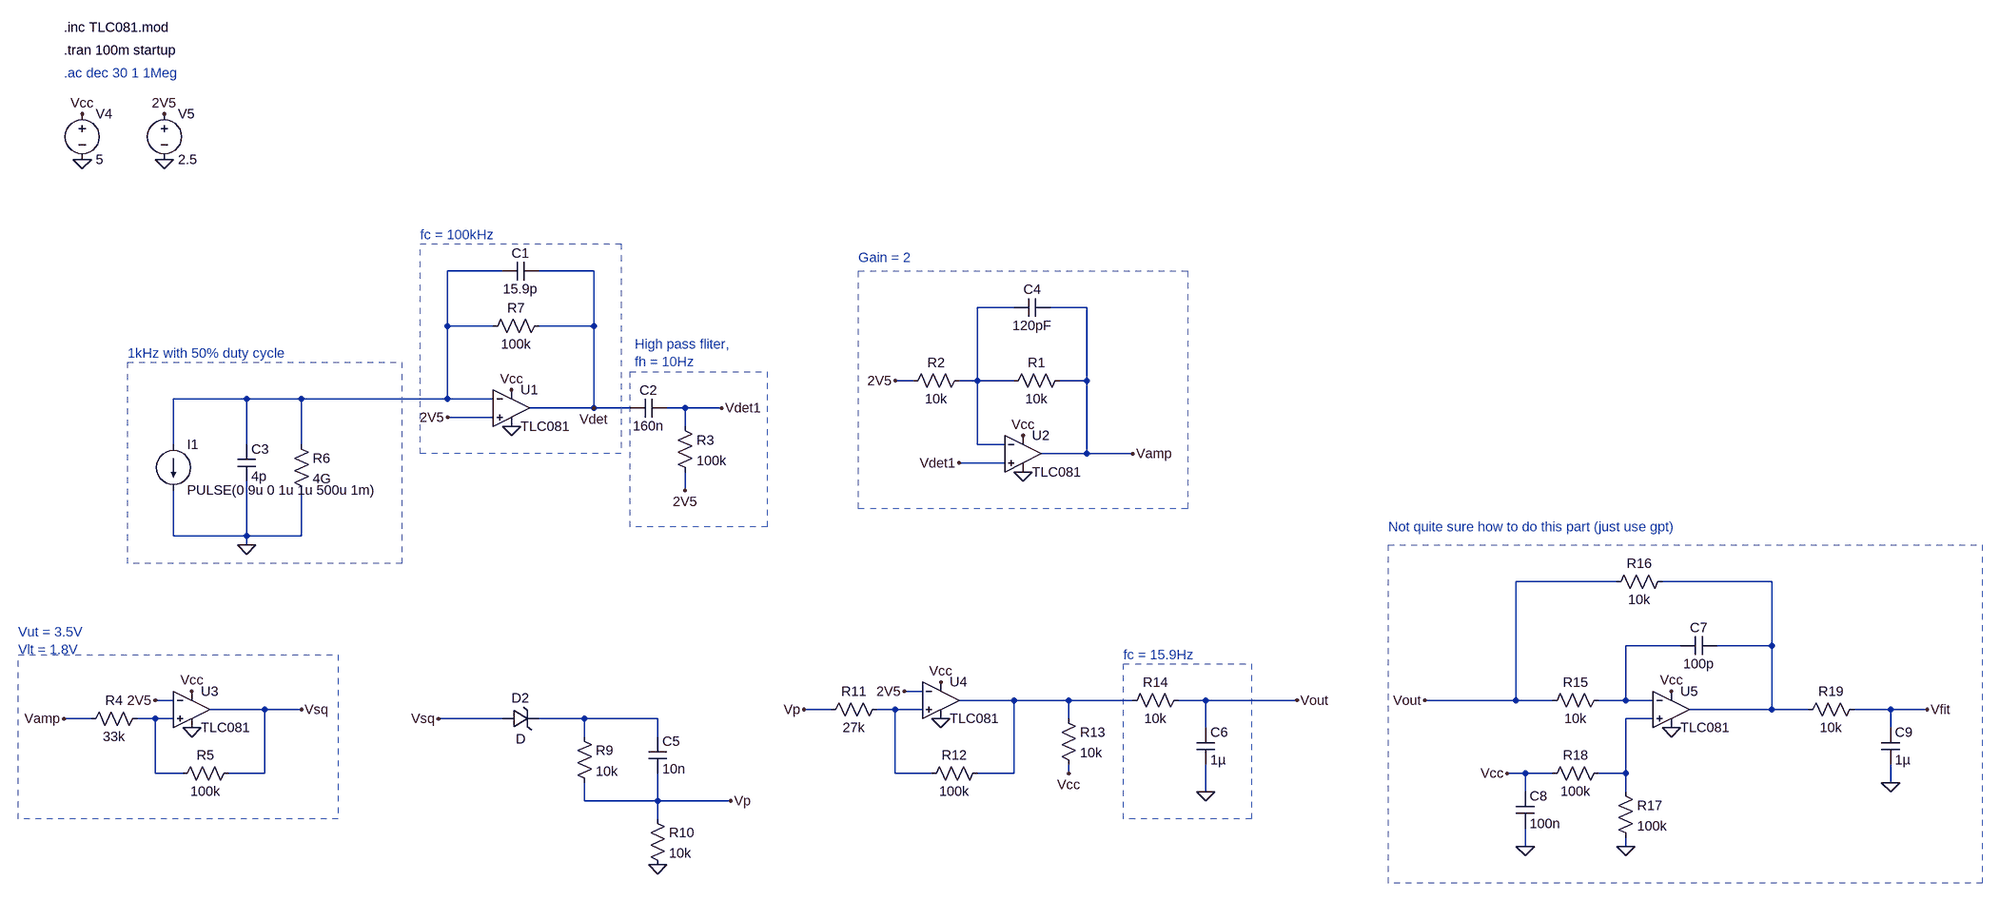
[diagram p0: schematic Receiver.asc]
Receiver.asc, the LTspice schematic file:
Version 4.1
SHEET 1 5412 1812
WIRE -224 736 -320 736
WIRE -64 736 -160 736
WIRE 672 800 608 800
WIRE 800 800 736 800
WIRE -320 832 -320 736
WIRE -240 832 -320 832
WIRE -64 832 -64 736
WIRE -64 832 -160 832
WIRE 496 928 464 928
WIRE 608 928 608 800
WIRE 608 928 576 928
WIRE 672 928 608 928
WIRE 800 928 800 800
WIRE 800 928 752 928
WIRE -672 960 -800 960
WIRE -576 960 -672 960
WIRE -320 960 -320 832
WIRE -320 960 -576 960
WIRE -240 960 -320 960
WIRE -64 976 -64 832
WIRE -64 976 -176 976
WIRE 0 976 -64 976
WIRE 96 976 64 976
WIRE 160 976 96 976
WIRE -240 992 -320 992
WIRE 96 1008 96 976
WIRE -800 1040 -800 960
WIRE -672 1040 -672 960
WIRE -576 1040 -576 960
WIRE 608 1040 608 928
WIRE 656 1040 608 1040
WIRE 800 1056 800 928
WIRE 800 1056 720 1056
WIRE 880 1056 800 1056
WIRE 656 1072 576 1072
WIRE 96 1120 96 1088
WIRE -800 1200 -800 1120
WIRE -672 1200 -672 1104
WIRE -672 1200 -800 1200
WIRE -576 1200 -576 1120
WIRE -576 1200 -672 1200
WIRE -672 1216 -672 1200
WIRE 1936 1280 1760 1280
WIRE 2208 1280 2016 1280
WIRE 2048 1392 1952 1392
WIRE 2208 1392 2208 1280
WIRE 2208 1392 2112 1392
WIRE 512 1472 480 1472
WIRE -800 1488 -832 1488
WIRE 672 1488 576 1488
WIRE 768 1488 672 1488
WIRE 880 1488 768 1488
WIRE 1008 1488 960 1488
WIRE 1168 1488 1008 1488
WIRE 1760 1488 1760 1280
WIRE 1760 1488 1600 1488
WIRE 1824 1488 1760 1488
WIRE 1952 1488 1952 1392
WIRE 1952 1488 1904 1488
WIRE 2000 1488 1952 1488
WIRE -640 1504 -736 1504
WIRE -576 1504 -640 1504
WIRE 352 1504 304 1504
WIRE 464 1504 432 1504
WIRE 512 1504 464 1504
WIRE 2208 1504 2208 1392
WIRE 2208 1504 2064 1504
WIRE 2272 1504 2208 1504
WIRE 2416 1504 2352 1504
WIRE 2480 1504 2416 1504
WIRE -944 1520 -992 1520
WIRE -832 1520 -864 1520
WIRE -800 1520 -832 1520
WIRE -224 1520 -336 1520
WIRE -80 1520 -160 1520
WIRE 48 1520 -80 1520
WIRE 768 1520 768 1488
WIRE 2000 1520 1952 1520
WIRE 1008 1536 1008 1488
WIRE 2416 1536 2416 1504
WIRE -80 1552 -80 1520
WIRE 48 1552 48 1520
WIRE -832 1616 -832 1520
WIRE -784 1616 -832 1616
WIRE -640 1616 -640 1504
WIRE -640 1616 -704 1616
WIRE 464 1616 464 1504
WIRE 528 1616 464 1616
WIRE 672 1616 672 1488
WIRE 672 1616 608 1616
WIRE 768 1616 768 1600
WIRE 1776 1616 1744 1616
WIRE 1824 1616 1776 1616
WIRE 1952 1616 1952 1520
WIRE 1952 1616 1904 1616
WIRE 2416 1632 2416 1600
WIRE 1008 1648 1008 1600
WIRE 1776 1648 1776 1616
WIRE 1952 1648 1952 1616
WIRE -80 1664 -80 1632
WIRE 48 1664 48 1616
WIRE 48 1664 -80 1664
WIRE 176 1664 48 1664
WIRE 48 1696 48 1664
WIRE 1776 1744 1776 1712
WIRE 1952 1744 1952 1728
FLAG -208 1008 0
FLAG -208 944 Vcc
FLAG -320 992 2V5
FLAG -960 464 0
FLAG -960 384 Vcc
FLAG -816 464 0
FLAG -816 384 2V5
FLAG -672 1216 0
FLAG 464 928 2V5
FLAG 688 1088 0
FLAG 688 1024 Vcc
FLAG 576 1072 Vdet1
FLAG 96 1120 2V5
FLAG 160 976 Vdet1
FLAG -64 976 Vdet
FLAG 880 1056 Vamp
FLAG -768 1472 Vcc
FLAG -768 1536 0
FLAG -992 1520 Vamp
FLAG -832 1488 2V5
FLAG -576 1504 Vsq
FLAG 48 1776 0
FLAG -336 1520 Vsq
FLAG 176 1664 Vp
FLAG 304 1504 Vp
FLAG 480 1472 2V5
FLAG 544 1520 0
FLAG 544 1456 Vcc
FLAG 768 1616 Vcc
FLAG 1008 1648 0
FLAG 1168 1488 Vout
FLAG 2032 1472 Vcc
FLAG 2032 1536 0
FLAG 1744 1616 Vcc
FLAG 1776 1744 0
FLAG 1952 1744 0
FLAG 2416 1632 0
FLAG 2480 1504 Vfit
FLAG 1600 1488 Vout
SYMBOL current -800 1040 R0
WINDOW 123 24 108 Left 2
WINDOW 39 0 0 Left 0
SYMATTR InstName I1
SYMATTR Value PULSE(0 9u 0 1u 1u 500u 1m)
SYMBOL cap -688 1040 R0
SYMATTR InstName C3
SYMATTR Value 4p
SYMBOL res -592 1024 R0
SYMATTR InstName R6
SYMATTR Value 4G
SYMBOL res -144 816 R90
WINDOW 0 0 56 VBottom 2
WINDOW 3 32 56 VTop 2
SYMATTR InstName R7
SYMATTR Value 100k
SYMBOL voltage -960 368 R0
SYMATTR InstName V4
SYMATTR Value 5
SYMBOL voltage -816 368 R0
WINDOW 123 0 0 Left 0
WINDOW 39 0 0 Left 0
SYMATTR InstName V5
SYMATTR Value 2.5
SYMBOL cap -160 720 R90
WINDOW 0 0 32 VBottom 2
WINDOW 3 32 32 VTop 2
SYMATTR InstName C1
SYMATTR Value 15.9p
SYMBOL res 768 912 R90
WINDOW 0 0 56 VBottom 2
WINDOW 3 32 56 VTop 2
SYMATTR InstName R1
SYMATTR Value 10k
SYMBOL res 592 912 R90
WINDOW 0 0 56 VBottom 2
WINDOW 3 32 56 VTop 2
SYMATTR InstName R2
SYMATTR Value 10k
SYMBOL cap 64 960 R90
WINDOW 0 0 32 VBottom 2
WINDOW 3 32 32 VTop 2
SYMATTR InstName C2
SYMATTR Value 160n
SYMBOL res 80 992 R0
SYMATTR InstName R3
SYMATTR Value 100k
SYMBOL cap 736 784 R90
WINDOW 0 0 32 VBottom 2
WINDOW 3 32 32 VTop 2
SYMATTR InstName C4
SYMATTR Value 120pF
SYMBOL res -848 1504 R90
WINDOW 0 0 56 VBottom 2
WINDOW 3 32 56 VTop 2
SYMATTR InstName R4
SYMATTR Value 33k
SYMBOL res -688 1600 R90
WINDOW 0 0 56 VBottom 2
WINDOW 3 32 56 VTop 2
SYMATTR InstName R5
SYMATTR Value 100k
SYMBOL zener -224 1536 R270
WINDOW 0 36 32 VTop 2
WINDOW 3 -4 32 VBottom 2
SYMATTR InstName D2
SYMBOL res -96 1536 R0
SYMATTR InstName R9
SYMATTR Value 10k
SYMBOL cap 32 1552 R0
SYMATTR InstName C5
SYMATTR Value 10n
SYMBOL res 32 1680 R0
SYMATTR InstName R10
SYMATTR Value 10k
SYMBOL res 448 1488 R90
WINDOW 0 0 56 VBottom 2
WINDOW 3 32 56 VTop 2
SYMATTR InstName R11
SYMATTR Value 27k
SYMBOL res 624 1600 R90
WINDOW 0 0 56 VBottom 2
WINDOW 3 32 56 VTop 2
SYMATTR InstName R12
SYMATTR Value 100k
SYMBOL res 752 1504 R0
SYMATTR InstName R13
SYMATTR Value 10k
SYMBOL res 976 1472 R90
WINDOW 0 0 56 VBottom 2
WINDOW 3 32 56 VTop 2
SYMATTR InstName R14
SYMATTR Value 10k
SYMBOL cap 992 1536 R0
SYMATTR InstName C6
SYMATTR Value 1µ
SYMBOL OpAmps\\opamp2 -208 912 R0
SYMATTR InstName U1
SYMATTR Value TLC081
SYMBOL OpAmps\\opamp2 688 992 R0
SYMATTR InstName U2
SYMATTR Value TLC081
SYMBOL OpAmps\\opamp2 -768 1440 R0
SYMATTR InstName U3
SYMATTR Value TLC081
SYMBOL OpAmps\\opamp2 544 1424 R0
SYMATTR InstName U4
SYMATTR Value TLC081
SYMBOL res 1920 1472 R90
WINDOW 0 0 56 VBottom 2
WINDOW 3 32 56 VTop 2
SYMATTR InstName R15
SYMATTR Value 10k
SYMBOL OpAmps\\opamp2 2032 1440 R0
SYMATTR InstName U5
SYMATTR Value TLC081
SYMBOL cap 2112 1376 R90
WINDOW 0 0 32 VBottom 2
WINDOW 3 32 32 VTop 2
SYMATTR InstName C7
SYMATTR Value 100p
SYMBOL res 2032 1264 R90
WINDOW 0 0 56 VBottom 2
WINDOW 3 32 56 VTop 2
SYMATTR InstName R16
SYMATTR Value 10k
SYMBOL res 1936 1632 R0
SYMATTR InstName R17
SYMATTR Value 100k
SYMBOL cap 1760 1648 R0
SYMATTR InstName C8
SYMATTR Value 100n
SYMBOL res 1920 1600 R90
WINDOW 0 0 56 VBottom 2
WINDOW 3 32 56 VTop 2
SYMATTR InstName R18
SYMATTR Value 100k
SYMBOL res 2368 1488 R90
WINDOW 0 0 56 VBottom 2
WINDOW 3 32 56 VTop 2
SYMATTR InstName R19
SYMATTR Value 10k
SYMBOL cap 2400 1536 R0
SYMATTR InstName C9
SYMATTR Value 1µ
TEXT -992 272 Left 2 !.tran 100m startup
TEXT -992 232 Left 2 !.inc TLC081.mod
TEXT -880 880 Left 2 ;1kHz with 50% duty cycle
TEXT -368 672 Left 2 ;fc = 100kHz
TEXT 8 864 Left 2 ;High pass fliter,\nfh = 10Hz
TEXT 400 712 Left 2 ;Gain = 2
TEXT -992 312 Left 2 ;.ac dec 30 1 1Meg
TEXT -1072 1368 Left 2 ;Vut = 3.5V\nVlt = 1.8V
TEXT 864 1408 Left 2 ;fc = 15.9Hz
TEXT 1536 1184 Left 2 ;Not quite sure how to do this part (just use gpt)
RECTANGLE Normal -400 1248 -880 896 2
RECTANGLE Normal -16 1056 -368 688 2
RECTANGLE Normal 240 1184 0 912 2
RECTANGLE Normal 976 1152 400 736 2
RECTANGLE Normal -512 1696 -1072 1408 2
RECTANGLE Normal 1088 1696 864 1424 2
RECTANGLE Normal 2576 1808 1536 1216 2

The netlist it stands for:
* Receiver.asc
I1 N001 0 PULSE(0 9u 0 1u 1u 500u 1m)
C3 N001 0 4p
R6 N001 0 4G
R7 Vdet N001 100k
V4 Vcc 0 5
V5 2V5 0 2.5
C1 Vdet N001 15.9p
R1 Vamp N002 10k
R2 N002 2V5 10k
C2 Vdet1 Vdet 160n
R3 Vdet1 2V5 100k
C4 Vamp N002 120pF
R4 N007 Vamp 33k
R5 Vsq N007 100k
D2 Vsq N008 D
R9 N008 Vp 10k
C5 N008 Vp 10n
R10 Vp 0 10k
R11 N006 Vp 27k
R12 N005 N006 100k
R13 N005 Vcc 10k
R14 Vout N005 10k
C6 Vout 0 1µ
X§U1 2V5 N001 Vcc 0 Vdet TLC081  ; pins In+ In- V+ V- OUT
X§U2 Vdet1 N002 Vcc 0 Vamp TLC081  ; pins In+ In- V+ V- OUT
X§U3 N007 2V5 Vcc 0 Vsq TLC081  ; pins In+ In- V+ V- OUT
X§U4 N006 2V5 Vcc 0 N005 TLC081  ; pins In+ In- V+ V- OUT
R15 N004 Vout 10k
X§U5 N009 N004 Vcc 0 N003 TLC081  ; pins In+ In- V+ V- OUT
C7 N003 N004 100p
R16 N003 Vout 10k
R17 N009 0 100k
C8 Vcc 0 100n
R18 N009 Vcc 100k
R19 Vfit N003 10k
C9 Vfit 0 1µ
.model D D
.lib standard.dio
.tran 100m startup
.inc TLC081.mod
* 1kHz with 50% duty cycle
* fc = 100kHz
* High pass fliter,
* fh = 10Hz
* Gain = 2
* .ac dec 30 1 1Meg
* Vut = 3.5V
* Vlt = 1.8V
* fc = 15.9Hz
* Not quite sure how to do this part (just use gpt)
.backanno
.end